# EAGLE design microfpga (EAGLE 9.0.0)
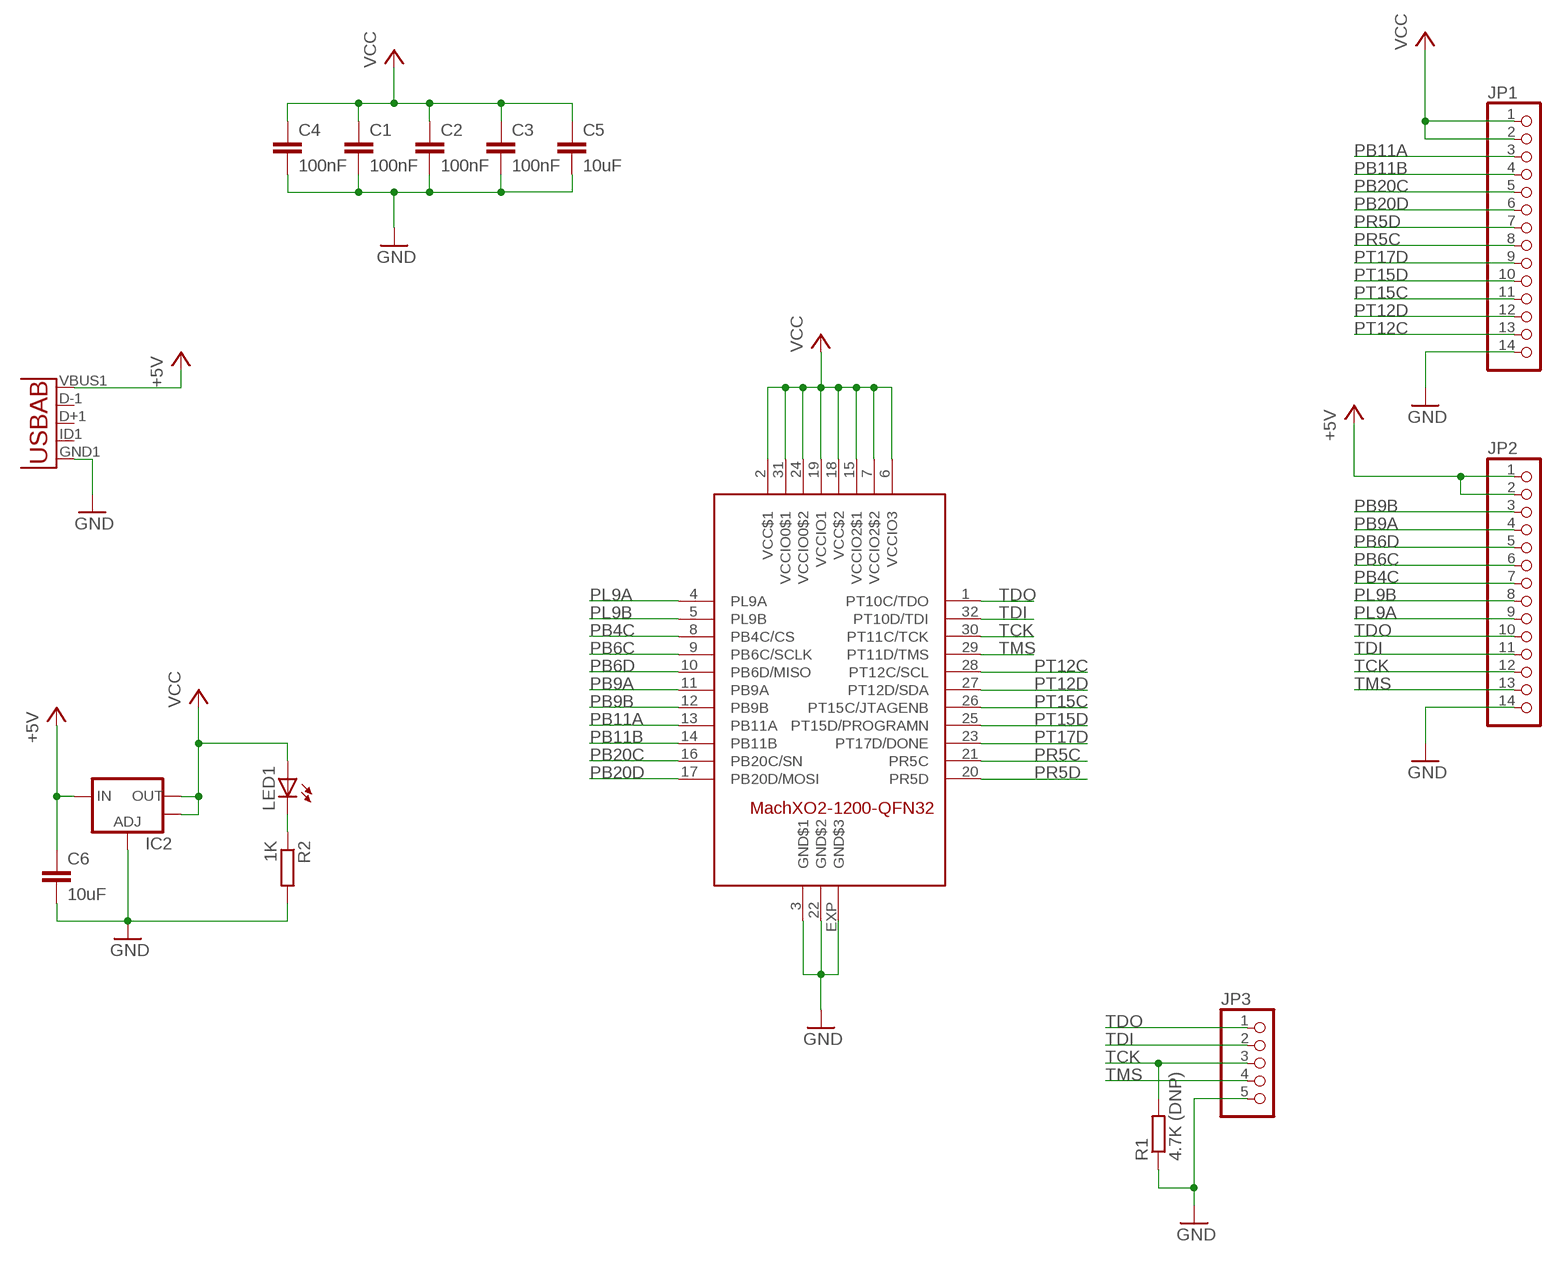
[diagram p0: schematic, sheet 1]

## Parts
C1  100nF  C-EUC0603  [C0603]
C2  100nF  C-EUC0603  [C0603]
C3  100nF  C-EUC0603  [C0603]
C4  100nF  C-EUC0603  [C0603]
C5  10uF  C-EUC0805  [C0805]
C6  10uF  C-EUC0805  [C0805]
IC2  V_REG_LM1117SOT223  [SOT223]
JP1  PINHD-1X14  [1X14]
JP2  PINHD-1X14  [1X14]
JP3  PINHD-1X5  [1X05]
LED1  LEDCHIPLED_0603  [CHIPLED_0603]
R1  4.7K (DNP)  R-EU_R0603  [R0603]
R2  1K  R-EU_R0603  [R0603]
U2  USB""  [USB-MICRO-SMD]
U$1  MACHXO2-1200  [QFN32]

## Nets
+5V: C6.1 IC2.3(IN) JP2.1 JP2.2 U2.VBUS1(VBUS)
GND: C1.2 C2.2 C3.2 C4.2 C5.2 C6.2 IC2.1(ADJ) JP1.14 JP2.14 JP3.5 R1.1 R2.2 U2.GND1(GND) U$1.3(GND$1) U$1.22(GND$2) U$1.EXP(GND$3)
N$1: LED1.C R2.1
PB4C: JP2.7 U$1.8(PB4C/CS)
PB6C: JP2.6 U$1.9(PB6C/SCLK)
PB6D: JP2.5 U$1.10(PB6D/MISO)
PB9A: JP2.4 U$1.11(PB9A)
PB9B: JP2.3 U$1.12(PB9B)
PB11A: JP1.3 U$1.13(PB11A)
PB11B: JP1.4 U$1.14(PB11B)
PB20C: JP1.5 U$1.16(PB20C/SN)
PB20D: JP1.6 U$1.17(PB20D/MOSI)
PL9A: JP2.9 U$1.4(PL9A)
PL9B: JP2.8 U$1.5(PL9B)
PR5C: JP1.8 U$1.21(PR5C)
PR5D: JP1.7 U$1.20(PR5D)
PT12C: JP1.13 U$1.28(PT12C/SCL)
PT12D: JP1.12 U$1.27(PT12D/SDA)
PT15C: JP1.11 U$1.26(PT15C/JTAGENB)
PT15D: JP1.10 U$1.25(PT15D/PROGRAMN)
PT17D: JP1.9 U$1.23(PT17D/DONE)
TCK: JP2.12 JP3.3 R1.2 U$1.30(PT11C/TCK)
TDI: JP2.11 JP3.2 U$1.32(PT10D/TDI)
TDO: JP2.10 JP3.1 U$1.1(PT10C/TDO)
TMS: JP2.13 JP3.4 U$1.29(PT11D/TMS)
VCC: C1.1 C2.1 C3.1 C4.1 C5.1 IC2.2(OUT) IC2.4(OUT) JP1.1 JP1.2 LED1.A U$1.2(VCC$1) U$1.6(VCCIO3) U$1.7(VCCIO2$2) U$1.15(VCCIO2$1) U$1.18(VCC$2) U$1.19(VCCIO1) U$1.24(VCCIO0$2) U$1.31(VCCIO0$1)
Unconnected: U2.D+1(D+) U2.D-1(D-) U2.ID1(USBID)

## Library data of the parts
C1-C6 = resistor:C-EU: CAPACITOR, European symbol
IC2 = SparkFun:V_REG_LM1117: Voltage Regulator LM1117 Standard adjustable voltage regulator but in SMD form. Spark Fun Electronics SKU : COM-00595
JP1 JP2 = pinhead:PINHD-1X14: PIN HEADER
JP3 = pinhead:PINHD-1X5: PIN HEADER
LED1 = led:LED: LED OSRAM: - CHIPLED LG R971, LG N971, LY N971, LG Q971, LY Q971, LO R971, LY R971 LH N974, LH R974 LS Q976, LO Q976, LY Q976 LO Q996 - Hyper CHIPLED LW Q18S LB Q993, LB Q99A, LB R99A - SideLED LS A670, LO A670, LY A670, LG A670, LP A670 LB A673, LV A673, LT A673, LW A673 LH A674 LY A675 LS A676, LA A676, LO A676, LY A676, LW A676 LS A679, LY A679, LG A679 - Hyper Micro SIDELED® LS Y876, LA Y876, LO Y876, LY Y876 LT Y87S - SmartLED LW L88C, LW L88S LB L89C, LB L89S, LG L890 LS L89K, LO L89K, LY L89K LS L896, LA L896, LO L896, LY L896 - TOPLED LS T670, LO T670, LY T670, LG T670, LP T670 LSG T670, LSP T670, LSY T670, LOP T670, LYG T670 LG T671, LOG T671, LSG T671 LB T673, LV T673, LT T673, LW T673 LH T674 LS T676, LA T676, LO T676, LY T676, LB T676, LH T676, LSB T676, LW T676 LB T67C, LV T67C, LT T67C, LS T67K, LO T67K, LY T67K, LW E67C LS E67B, LA E67B, LO E67B, LY E67B, LB E67C, LV E67C, LT E67C LW T67C LS T679, LY T679, LG T679 LS T770, LO T770, LY T770, LG T770, LP T770 LB T773, LV T773, LT T773, LW T773 LH T774 LS E675, LA E675, LY E675, LS T675 LS T776, LA T776, LO T776, LY T776, LB T776 LHGB T686 LT T68C, LB T68C - Hyper Mini TOPLED® LB M676 - Mini TOPLED Santana® LG M470 LS M47K, LO M47K, LY M47K Source: http://www.osram.convergy.de LUXEON: - LUMILED® LXK2-PW12-R00, LXK2-PW12-S00, LXK2-PW14-U00, LXK2-PW14-V00 LXK2-PM12-R00, LXK2-PM12-S00, LXK2-PM14-U00 LXK2-PE12-Q00, LXK2-PE12-R00, LXK2-PE12-S00, LXK2-PE14-T00, LXK2-PE14-U00 LXK2-PB12-K00, LXK2-PB12-L00, LXK2-PB12-M00, LXK2-PB14-N00, LXK2-PB14-P00, LXK2-PB14-Q00 LXK2-PR12-L00, LXK2-PR12-M00, LXK2-PR14-Q00, LXK2-PR14-R00 LXK2-PD12-Q00, LXK2-PD12-R00, LXK2-PD12-S00 LXK2-PH12-R00, LXK2-PH12-S00 LXK2-PL12-P00, LXK2-PL12-Q00, LXK2-PL12-R00 Source: www.luxeon.com KINGBRIGHT: KA-3528ASYC Source: www.kingbright.com
R1 R2 = resistor:R-EU_: RESISTOR, European symbol
U2 = MicroUSB:USB: This is a USB AB connector that is compatible with USB OTG. i.e. this connector can serve as a host or device
U$1 = addons-lib:MACHXO2-1200

## Board
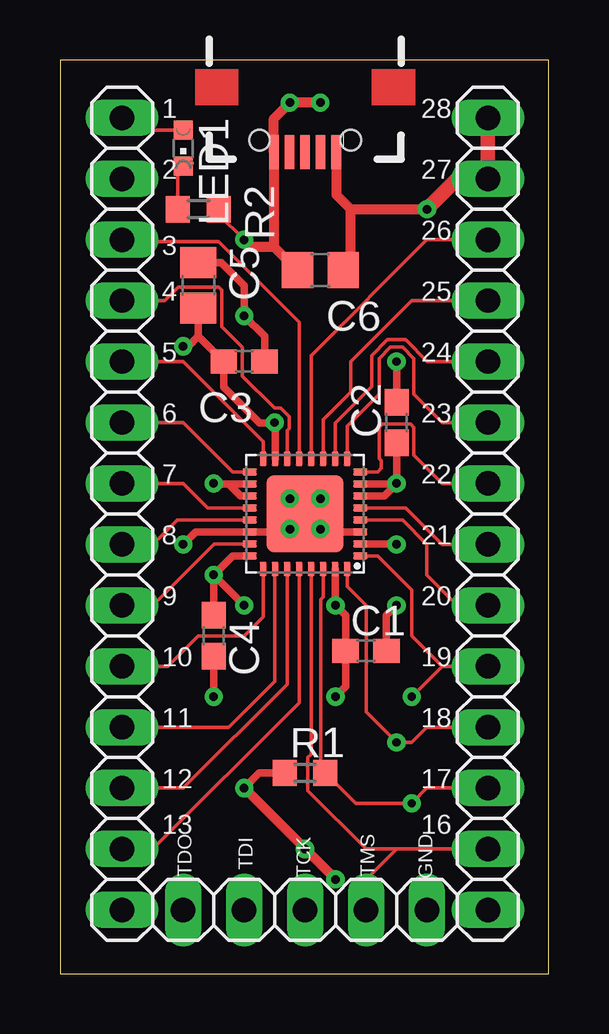
[diagram p1: board, top side]
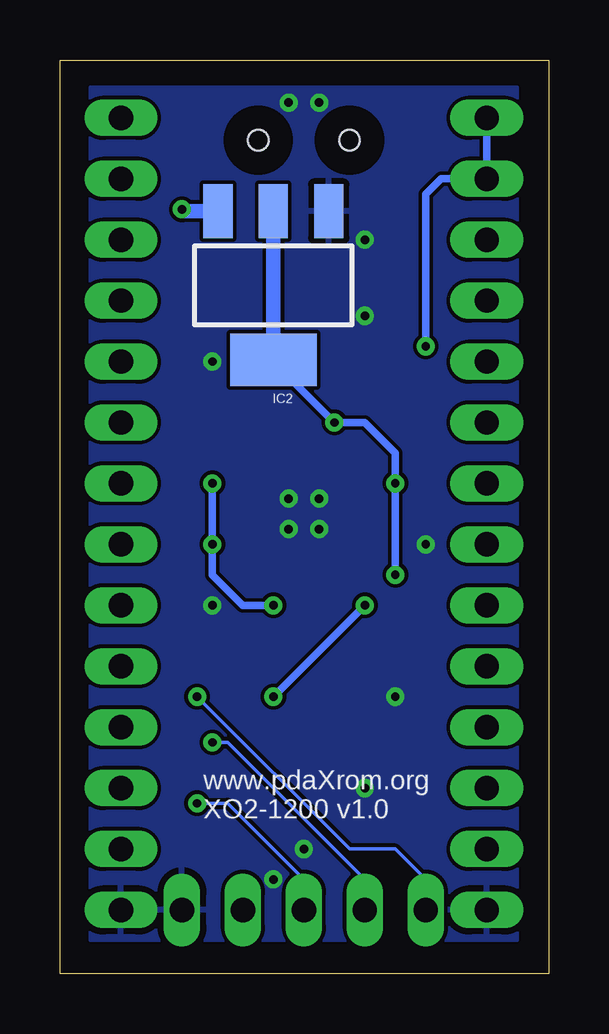
[diagram p2: board, bottom side, seen from below]

Size 20.37 x 38.09 mm. Coordinates in mm from the lower left corner, seen from the top.
Outline: 20.37,38.09 0,38.09 0,0 20.37,0 20.37,38.09
Copper layers (1*16): Top 0.035mm / dielectric 1.5mm / Bottom 0.035mm
Design rules "default *": minimum track width 6mil, minimum drill 0.35mm, track to track 6mil, track to pad 6mil, pad to pad 6mil, via to via 6mil, smd to smd 6mil, copper to edge 40mil, drill to drill 6mil, minimum pad ring 10mil, minimum via ring 8mil, stop-mask expansion 4mil, vias tented up to drill 23mil, thermal gap 10mil

### Footprints (pad centres in the part's own frame; a part is rotated, then mirrored left to right if it is on the bottom)
C0603 = smd 1.1 x 1: 1 -0.85,0; 2 0.85,0
C0805 = smd 1.3 x 1.5: 1 -0.95,0; 2 0.95,0
SOT223 = smd 1.219 x 2.235: 1 -2.311,-3.099; 2 0,-3.099; 3 2.311,-3.099 | smd 3.6 x 2.2: 4 0,3.099
1X14 = drill 1.016 long: 1 -16.51,0; 2 -13.97,0; 3 -11.43,0; 4 -8.89,0; 5 -6.35,0; 6 -3.81,0; 7 -1.27,0; 8 1.27,0; 9 3.81,0; 10 6.35,0; 11 8.89,0; 12 11.43,0; 13 13.97,0; 14 16.51,0
1X05 = drill 1.016 long: 1 -5.08,0; 2 -2.54,0; 3 0,0; 4 2.54,0; 5 5.08,0
CHIPLED_0603 = smd 0.8 x 0.8: A 0,-0.75; C 0,0.75
R0603 = smd 1 x 1.1: 1 -0.85,0; 2 0.85,0
USB-MICRO-SMD = smd 1.4 x 0.4: D+1 2.7,0; D-1 2.7,0.65; GND1 2.7,-1.3; ID1 2.7,-0.65; VBUS1 2.7,1.3 | hole 0.85: 2.2,1.9; 2.2,-1.9
QFN32 = smd 0.6 x 0.3: 1 -2.3,1.75; 2 -2.3,1.25; 3 -2.3,0.75; 4 -2.3,0.25; 5 -2.3,-0.25; 6 -2.3,-0.75; 7 -2.3,-1.25; 8 -2.3,-1.75; 17 2.3,-1.75; 18 2.3,-1.25; 19 2.3,-0.75; 20 2.3,-0.25; 21 2.3,0.25; 22 2.3,0.75; 23 2.3,1.25; 24 2.3,1.75 | smd 0.3 x 0.6: 9 -1.75,-2.3; 10 -1.25,-2.3; 11 -0.75,-2.3; 12 -0.25,-2.3; 13 0.25,-2.3; 14 0.75,-2.3; 15 1.25,-2.3; 16 1.75,-2.3; 25 1.75,2.3; 26 1.25,2.3; 27 0.75,2.3; 28 0.25,2.3; 29 -0.25,2.3; 30 -0.75,2.3; 31 -1.25,2.3; 32 -1.75,2.3 | smd 3.2 x 3.2: EXP 0,0

### Placement (x,y rotation side)
C1  12.75,13.45 0 top
C2  14.02,22.98 90 top
C3  7.67,25.52 0 top
C4  6.4,14.09 270 top
C5  5.77,28.69 90 top
C6  10.85,29.33 180 top
IC2  11.48,28.69 180 bottom
JP1  2.59,19.17 270 top
JP2  17.83,19.17 270 top
JP3  10.21,2.66 0 top
LED1  5.13,34.41 180 top
R1  10.21,8.37 0 top
R2  5.77,31.87 0 top
U2  10.21,36.95 270 top
U$1  10.21,19.17 180 top

### Tracks (layer width: path | path; a pad name or v marks a point on that pad's centre or on a via)
+5V  (via drill 0.35)
  Top 0.406: U2.VBUS1 11.51,32.47 12.12,31.87 | 12.12,31.87 v15.29,31.87 | C6.1 12.12,29.65 12.12,31.87
  Top 0.61: JP2.1 JP2.2 16.56,33.14 v15.29,31.87
  Bottom 0.61: IC2.3 15.21,31.79 v15.29,31.87
GND  (via drill 0.35)
  Top 0.152: v10.85,18.53 U$1.EXP 9.46,18.42 | v7.67,30.6 6.62,31.65 R2.2
  Top 0.305: R1.1 8.31,8.37 v7.67,7.74 | C4.2 v6.4,11.55 | C1.2 13.6,14.94 v14.02,15.36 | C3.2 8.52,26.57 v7.67,27.42 7.67,28.69 6.72,29.64 C5.2 | C2.2 v14.02,25.52 | 9.46,18.42 U$1.22 5.65,18.42 v5.13,17.9 | U$1.3 10.96,18.42 v10.85,18.53
  Top 0.406: 8.91,30.31 C6.2 | 8.91,30.31 U2.GND1 8.91,35.65 v9.58,36.31 v10.85,36.31 | v7.67,30.6 7.96,30.31 8.91,30.31 | v11.48,3.93 v10.21,5.2 v7.67,7.74
  other vias: 9.58,18.53 10.85,19.8 9.58,19.8
  pour Bottom: 19.1,36.95 1.32,36.95 1.32,1.39 19.1,1.39
N$1
  Top 0.152: R2.1 4.92,33.44 LED1.C
PB4C
  Top 0.152: U$1.8 13.23,20.92 13.39,21.07 13.39,21.39 13.29,21.48 13.29,22.77 13.43,22.91 14.62,22.91 14.75,22.77 14.75,21.61 15.93,20.44 JP2.7
PB6C
  Top 0.152: U$1.9 11.96,22.82 13.29,24.15 13.29,25.65 13.77,26.12 14.27,26.12 14.75,25.65 14.75,24.15 15.93,22.98 JP2.6
PB6D
  Top 0.152: U$1.10 11.46,22.96 12.99,24.48 12.99,25.77 13.64,26.43 14.4,26.43 15.31,25.52 JP2.5
PB9A
  Top 0.152: U$1.11 10.96,23.09 12.12,24.25 12.12,25.52 14.66,28.06 JP2.4
PB9B
  Top 0.152: JP2.3 15.29,30.6 10.46,25.77 U$1.12
PB11A
  Top 0.152: JP1.3 2.67,30.52 6.61,30.52 9.96,27.17 U$1.13
PB11B
  Top 0.152: U$1.14 9.46,22.64 9.55,22.73 9.55,23.23 9.19,23.58 8.94,23.58 7.6,24.92 7.6,26.11 6.75,26.97 6.75,28.49 6.61,28.62 4.92,28.62 4.36,28.06 JP1.4
PB20C
  Top 0.152: JP1.5 5.13,25.52 8.46,22.19 U$1.16
PB20D
  Top 0.152: JP1.6 5.13,22.98 7.19,20.92 U$1.17
PL9A
  Top 0.152: U$1.4 14.27,18.92 15.29,17.9 15.29,16.63 16.56,15.36 JP2.9
PL9B
  Top 0.152: U$1.5 14.41,19.42 15.93,17.9 JP2.8
PR5C
  Top 0.152: U$1.21 4.88,18.92 3.86,17.9 JP1.8
PR5D
  Top 0.152: 3.86,20.44 JP1.7 5.13,20.44 6.15,19.42 U$1.20
PT12C
  Top 0.152: U$1.28 9.96,11.3 3.86,5.2 JP1.13
PT12D
  Top 0.152: U$1.27 9.46,12.07 5.13,7.74 JP1.12
PT15C
  Top 0.152: U$1.26 8.94,16.85 8.94,12.18 7.04,10.28 JP1.11
PT15D
  Top 0.152: U$1.25 8.46,14.88 7.67,14.09 5.77,14.09 4.5,12.82 JP1.10
PT17D
  Top 0.152: U$1.23 6.42,17.92 3.86,15.36 JP1.9
TCK  (via drill 0.35)
  Top 0.152: JP2.12 15.29,7.74 v14.66,7.1 12.33,7.1 R1.2 10.87,8.56 10.87,15.61 10.96,15.7 U$1.30
  Bottom 0.152: v14.66,7.1 13.39,7.1 10.21,3.93 JP3.3
TDI  (via drill 0.35)
  Top 0.152: U$1.32 11.96,16.15 12.75,15.36 12.75,10.91 v14.02,9.64 14.66,9.64 15.29,10.28 JP2.11
  Bottom 0.152: JP3.2 7.67,3.93 13.39,9.64 v14.02,9.64
TDO  (via drill 0.35)
  Top 0.152: 15.93,12.82 JP2.10 | 15.93,12.82 v14.66,11.55 | U$1.1 13.23,17.42 14.66,15.99 14.66,14.09 15.93,12.82
  Bottom 0.152: JP3.1 5.13,3.93 6.4,5.2 8.31,5.2 v14.66,11.55
TMS
  Top 0.152: 14.02,5.2 JP2.13 | 14.02,5.2 12.75,3.93 JP3.4 | U$1.29 10.46,9.14 10.33,9.02 10.33,7.62 12.75,5.2 14.02,5.2
VCC  (via drill 0.35)
  Top 0.152: LED1.A 3.11,35.16 JP1.1
  Top 0.305: U$1.2 14,17.92 v14.02,17.9 | U$1.31 11.46,15.38 v11.48,15.36 11.9,14.94 C1.1 11.9,11.97 v11.48,11.55 | U$1.18 7.04,20.42 | 7.04,20.42 6.42,20.42 v6.4,20.44 | U$1.19 7.54,19.92 7.04,20.42 | U$1.15 8.96,22.96 | 8.96,22.96 v8.94,22.98 | U$1.24 7.19,17.42 v6.4,16.63 | C4.1 v6.4,16.63 | v7.67,15.36 v6.4,16.63 | 8.96,22.96 8.33,22.96 6.82,24.46 C3.1 5.77,26.57 | U$1.7 14,20.42 | 14,20.42 v14.02,20.44 C2.1 | U$1.6 13.5,19.92 14,20.42 | 5.77,26.57 C5.1 | 5.77,26.57 5.35,26.15 v5.13,26.15
  Bottom 0.305: v11.48,15.36 12.75,15.36 14.02,16.63 v14.02,17.9 v14.02,20.44 | v6.4,16.63 v6.4,20.44 6.4,21.71 7.67,22.98 v8.94,22.98 11.48,25.52 IC2.4 | v5.13,26.15 5.13,32.5 4.5,33.14 JP1.2 JP1.1 | v7.67,15.36 v11.48,11.55
  Bottom 0.61: IC2.2 IC2.4

### Text on the board
tPlace: 1 | 28 | 2 | 27 | 26 | 3 | 4 | 25 | 5 | 24 | 6 | 23 | 7 | 22 | 8 | 21 | 9 | 20 | 10 | 19 | 11 | 18 | 12 | 17 | 13 | TDO | TDI | TCK | TMS | GND | 16
bPlace: www.pdaXrom.org / XO2-1200 v1.0